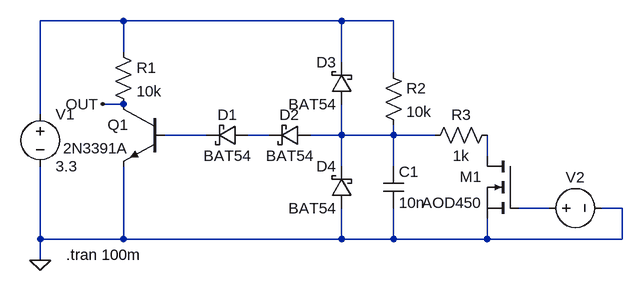
[diagram p0: schematic digital-input-conditioner.asc]
digital-input-conditioner.asc, the LTspice schematic file:
Version 4.1
SHEET 1 900 680
WIRE 128 0 0 0
WIRE 464 0 128 0
WIRE 544 0 464 0
WIRE 128 48 128 0
WIRE 464 64 464 0
WIRE 544 80 544 0
WIRE 128 128 96 128
WIRE 0 144 0 0
WIRE 256 176 192 176
WIRE 352 176 320 176
WIRE 464 176 464 128
WIRE 464 176 416 176
WIRE 544 176 544 160
WIRE 544 176 464 176
WIRE 608 176 544 176
WIRE 688 208 688 176
WIRE 464 224 464 176
WIRE 544 224 544 176
WIRE 784 288 736 288
WIRE 896 288 864 288
WIRE 0 336 0 224
WIRE 128 336 128 224
WIRE 128 336 0 336
WIRE 464 336 464 288
WIRE 464 336 128 336
WIRE 544 336 544 288
WIRE 544 336 464 336
WIRE 688 336 688 304
WIRE 688 336 544 336
WIRE 896 336 896 288
WIRE 896 336 688 336
WIRE 0 368 0 336
FLAG 0 368 0
FLAG 96 128 OUT
SYMBOL voltage 0 128 R0
WINDOW 123 0 0 Left 0
WINDOW 39 0 0 Left 0
SYMATTR InstName V1
SYMATTR Value 3.3
SYMBOL res 112 32 R0
SYMATTR InstName R1
SYMATTR Value 10k
SYMBOL res 528 64 R0
SYMATTR InstName R2
SYMATTR Value 10k
SYMBOL res 704 160 R90
WINDOW 0 0 56 VBottom 2
WINDOW 3 32 56 VTop 2
SYMATTR InstName R3
SYMATTR Value 1k
SYMBOL npn 192 128 M0
SYMATTR InstName Q1
SYMATTR Value 2N3391A
SYMBOL schottky 480 128 R180
WINDOW 0 24 64 Left 2
WINDOW 3 24 0 Left 2
SYMATTR InstName D3
SYMATTR Value BAT54
SYMATTR Description Diode
SYMATTR Type diode
SYMBOL schottky 480 288 R180
WINDOW 0 24 64 Left 2
WINDOW 3 24 0 Left 2
SYMATTR InstName D4
SYMATTR Value BAT54
SYMATTR Description Diode
SYMATTR Type diode
SYMBOL schottky 416 160 R90
WINDOW 0 0 32 VBottom 2
WINDOW 3 32 32 VTop 2
SYMATTR InstName D2
SYMATTR Value BAT54
SYMATTR Description Diode
SYMATTR Type diode
SYMBOL schottky 320 160 R90
WINDOW 0 0 32 VBottom 2
WINDOW 3 32 32 VTop 2
SYMATTR InstName D1
SYMATTR Value BAT54
SYMATTR Description Diode
SYMATTR Type diode
SYMBOL nmos 736 208 M0
SYMATTR InstName M1
SYMATTR Value AOD450
SYMBOL voltage 768 288 R270
WINDOW 0 32 56 VTop 2
WINDOW 3 -32 56 Invisible 2
WINDOW 123 0 0 Left 0
WINDOW 39 0 0 Left 0
SYMATTR InstName V2
SYMATTR Value PULSE(0 10 0 1n 1n 10m 20m)
SYMBOL cap 528 224 R0
SYMATTR InstName C1
SYMATTR Value 10n
TEXT 40 360 Left 2 !.tran 100m

The netlist it stands for:
* digital-input-conditioner.asc
V1 N001 0 3.3
R1 N001 OUT 10k
R2 N001 N004 10k
R3 N005 N004 1k
Q1 OUT N002 0 0 2N3391A
D3 N004 N001 BAT54
D4 0 N004 BAT54
D2 N004 N003 BAT54
D1 N003 N002 BAT54
M1 N005 N006 0 0 AOD450
V2 N006 0 PULSE(0 10 0 1n 1n 10m 20m)
C1 N004 0 10n
.model D D
.lib standard.dio
.model NPN NPN
.model PNP PNP
.lib standard.bjt
.model NMOS NMOS
.model PMOS PMOS
.lib standard.mos
.tran 100m
.backanno
.end